# EAGLE design MicromouseV0.0.5 (EAGLE 9.4.2)
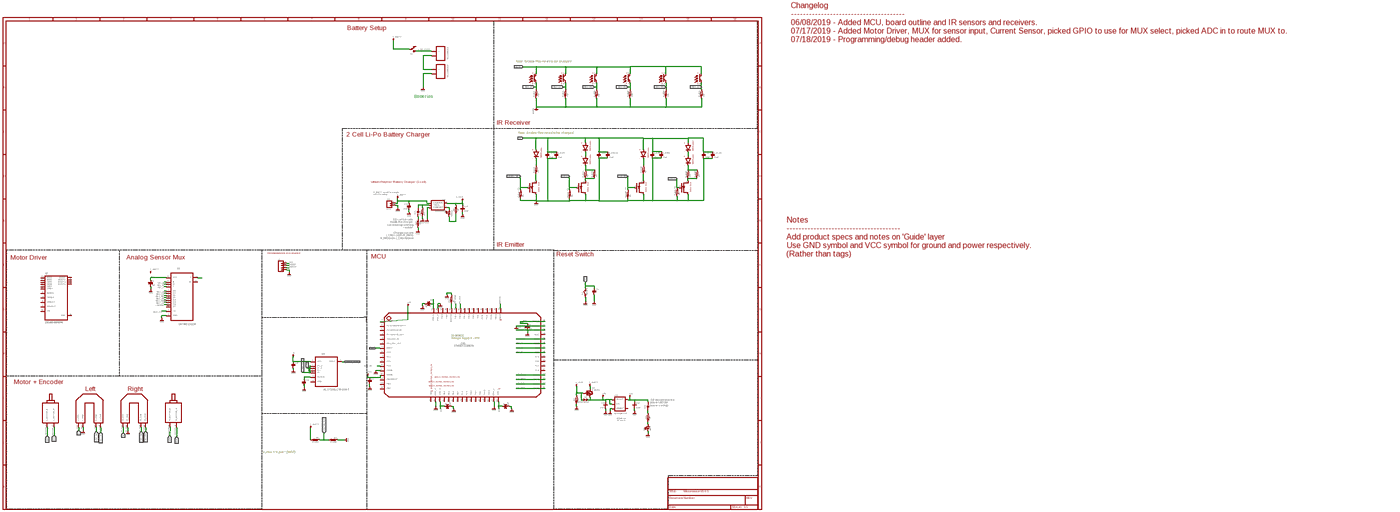
[diagram p0: schematic, sheet 1, overview]
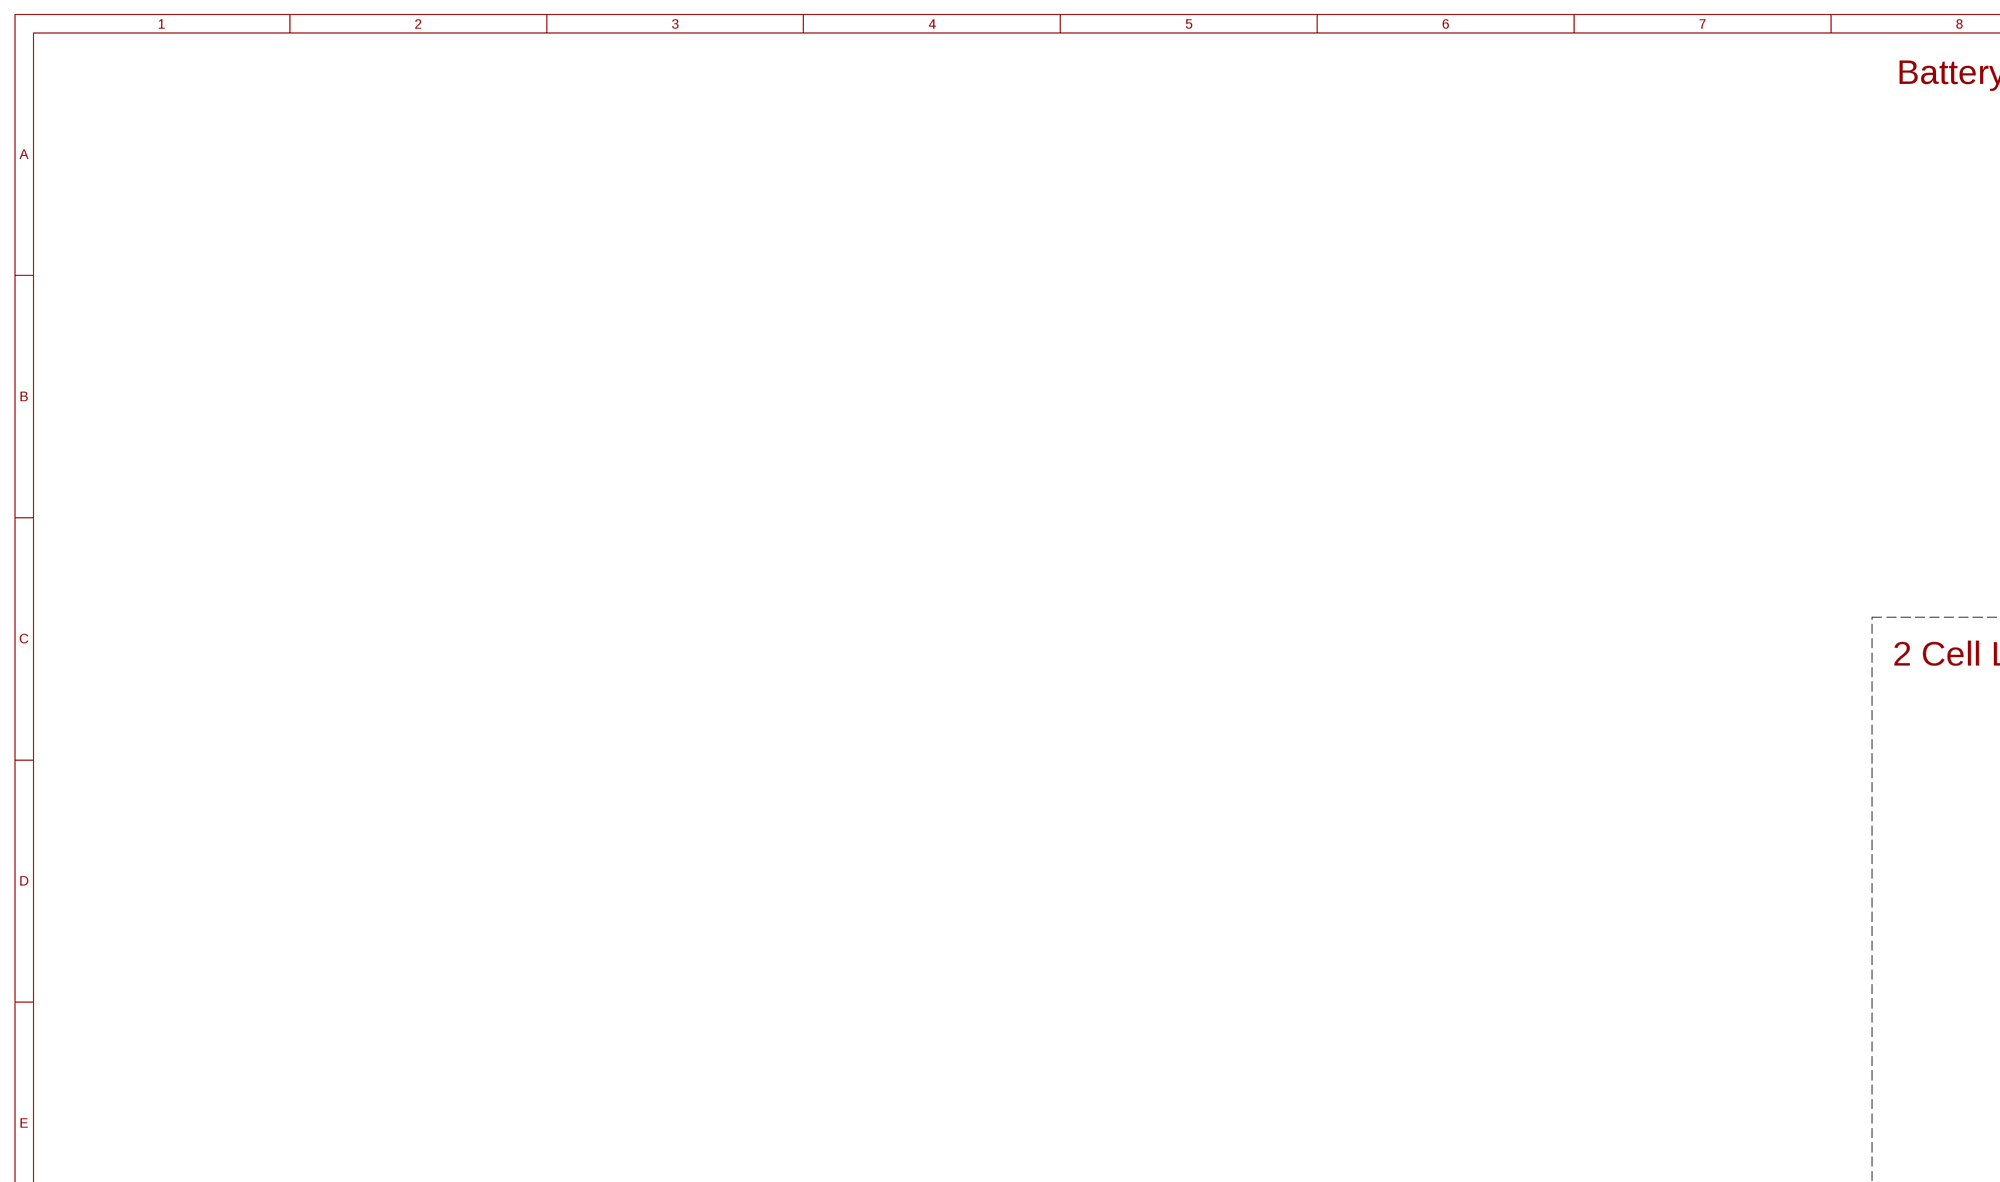
[diagram p1: schematic, sheet 1, part 1 of 6]
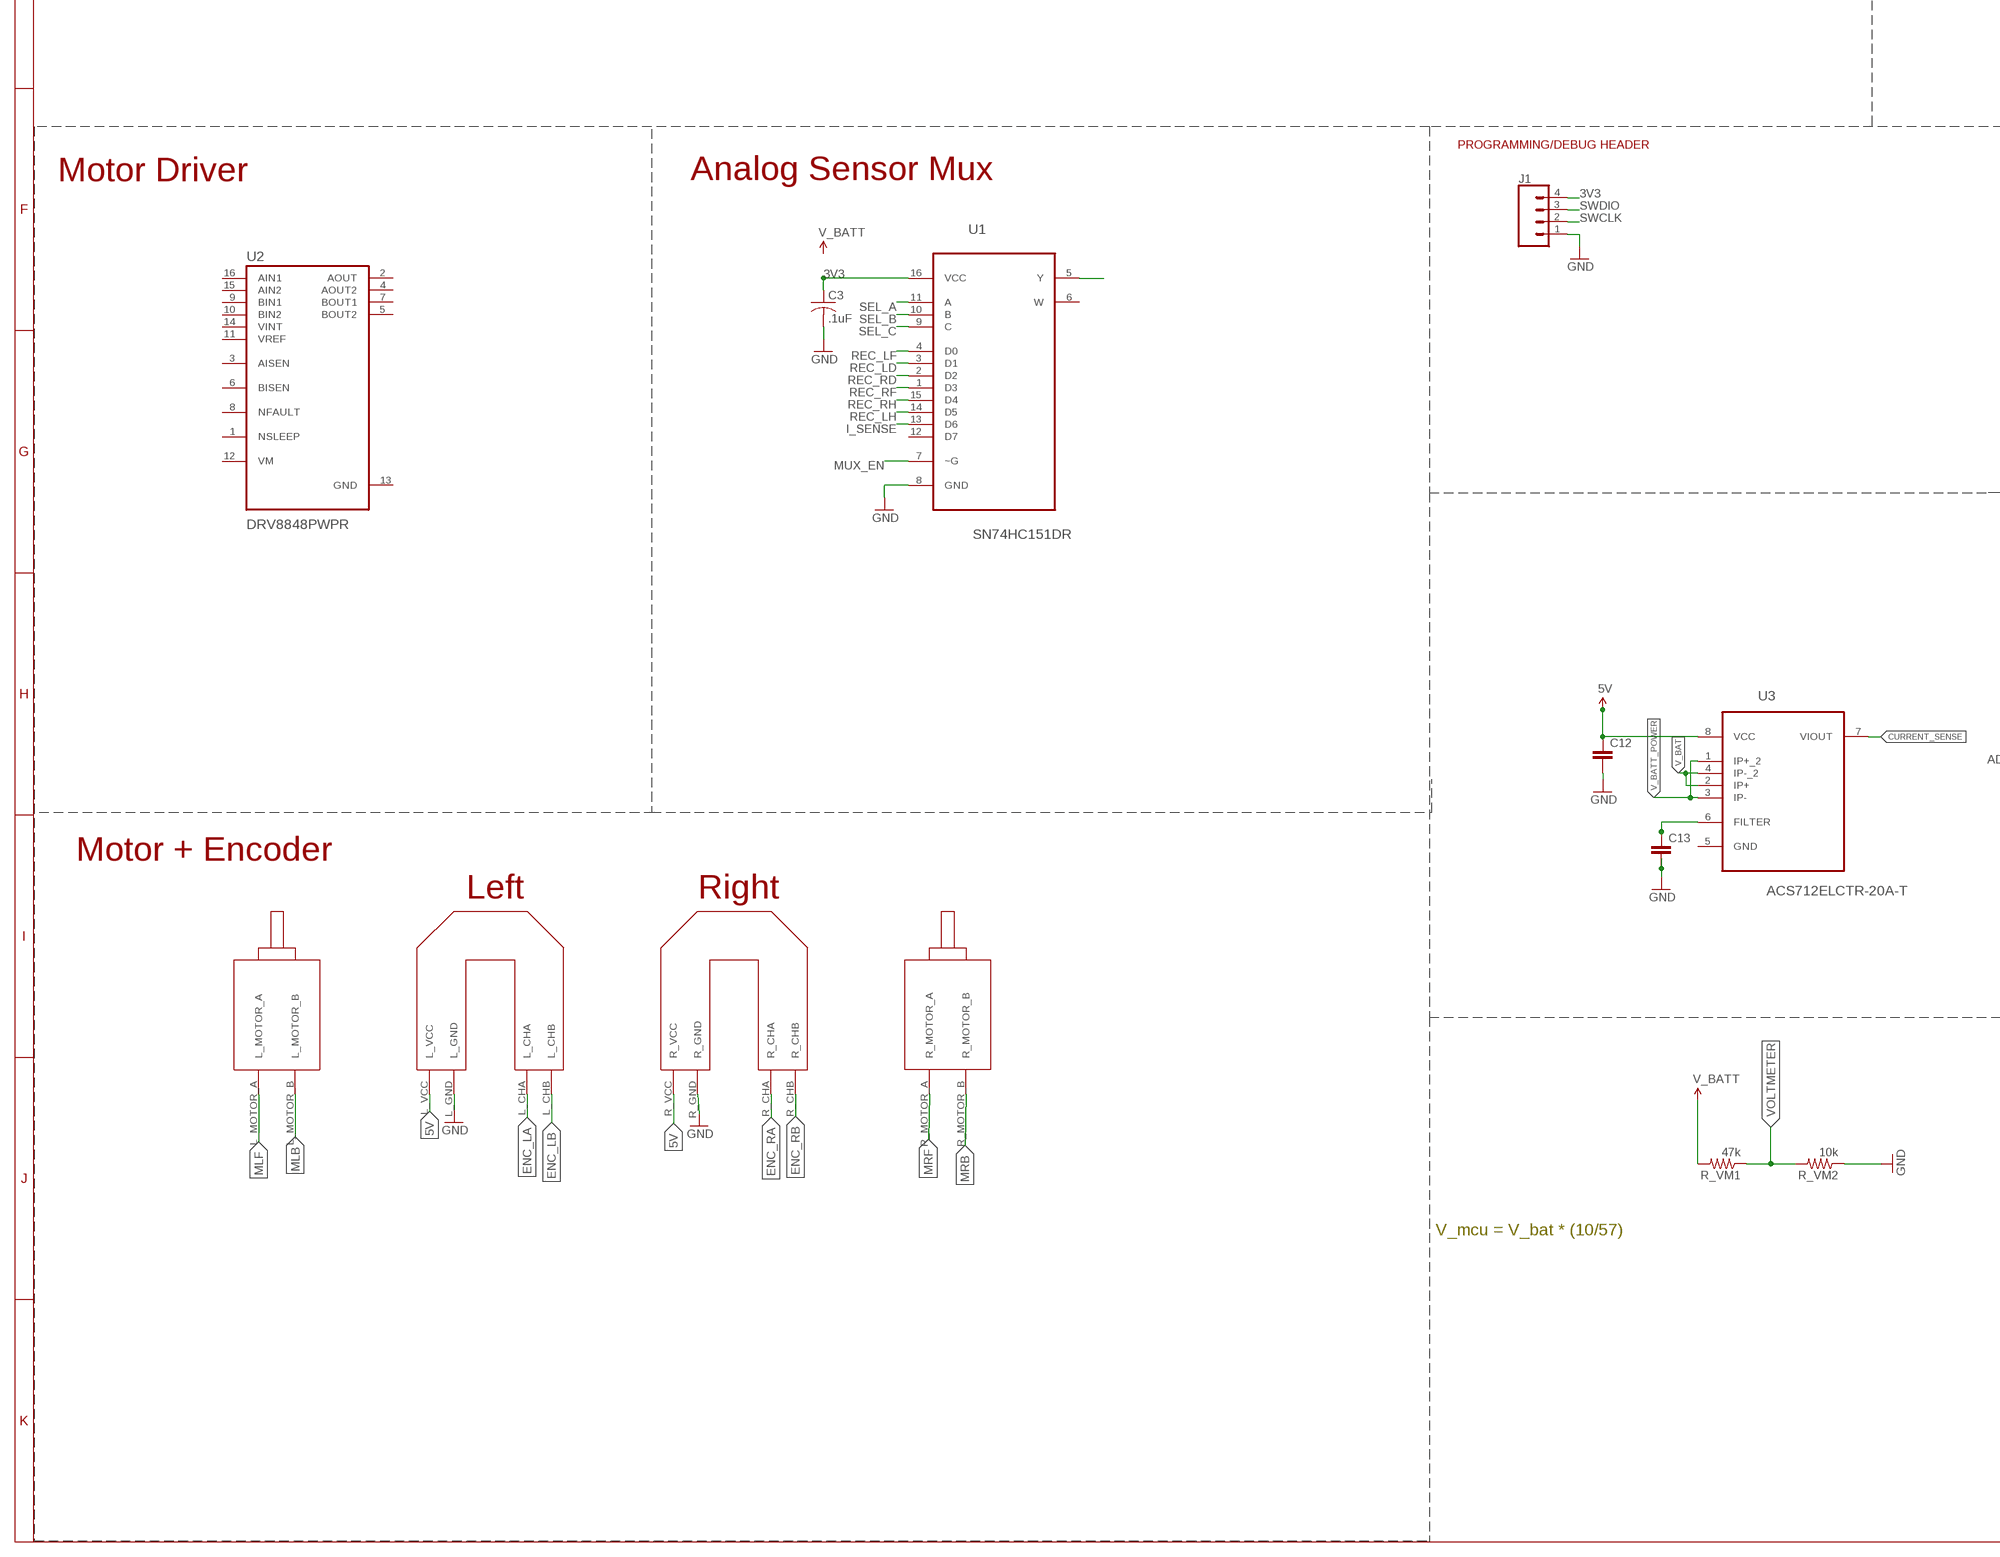
[diagram p2: schematic, sheet 1, part 2 of 6]
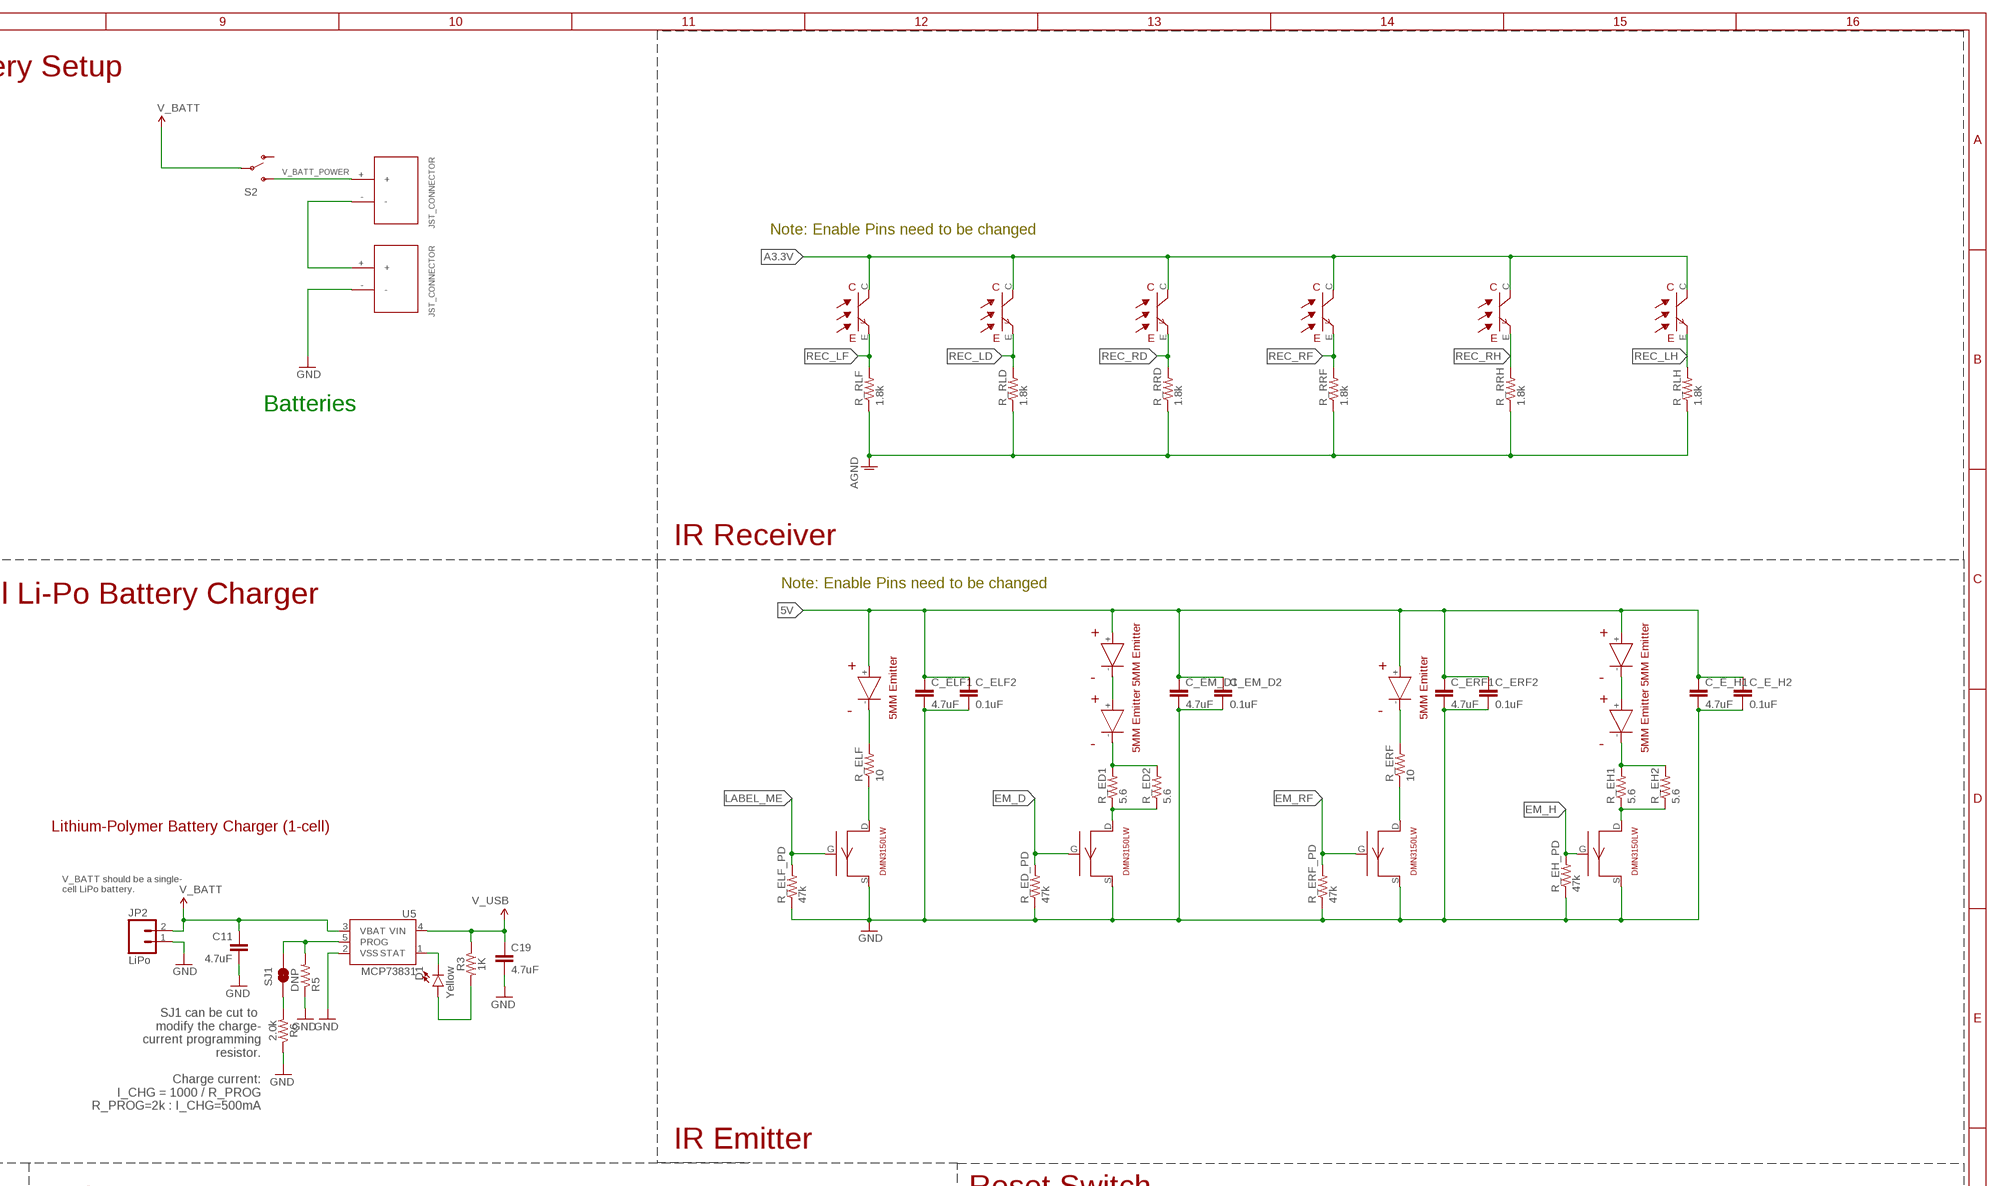
[diagram p3: schematic, sheet 1, part 3 of 6]
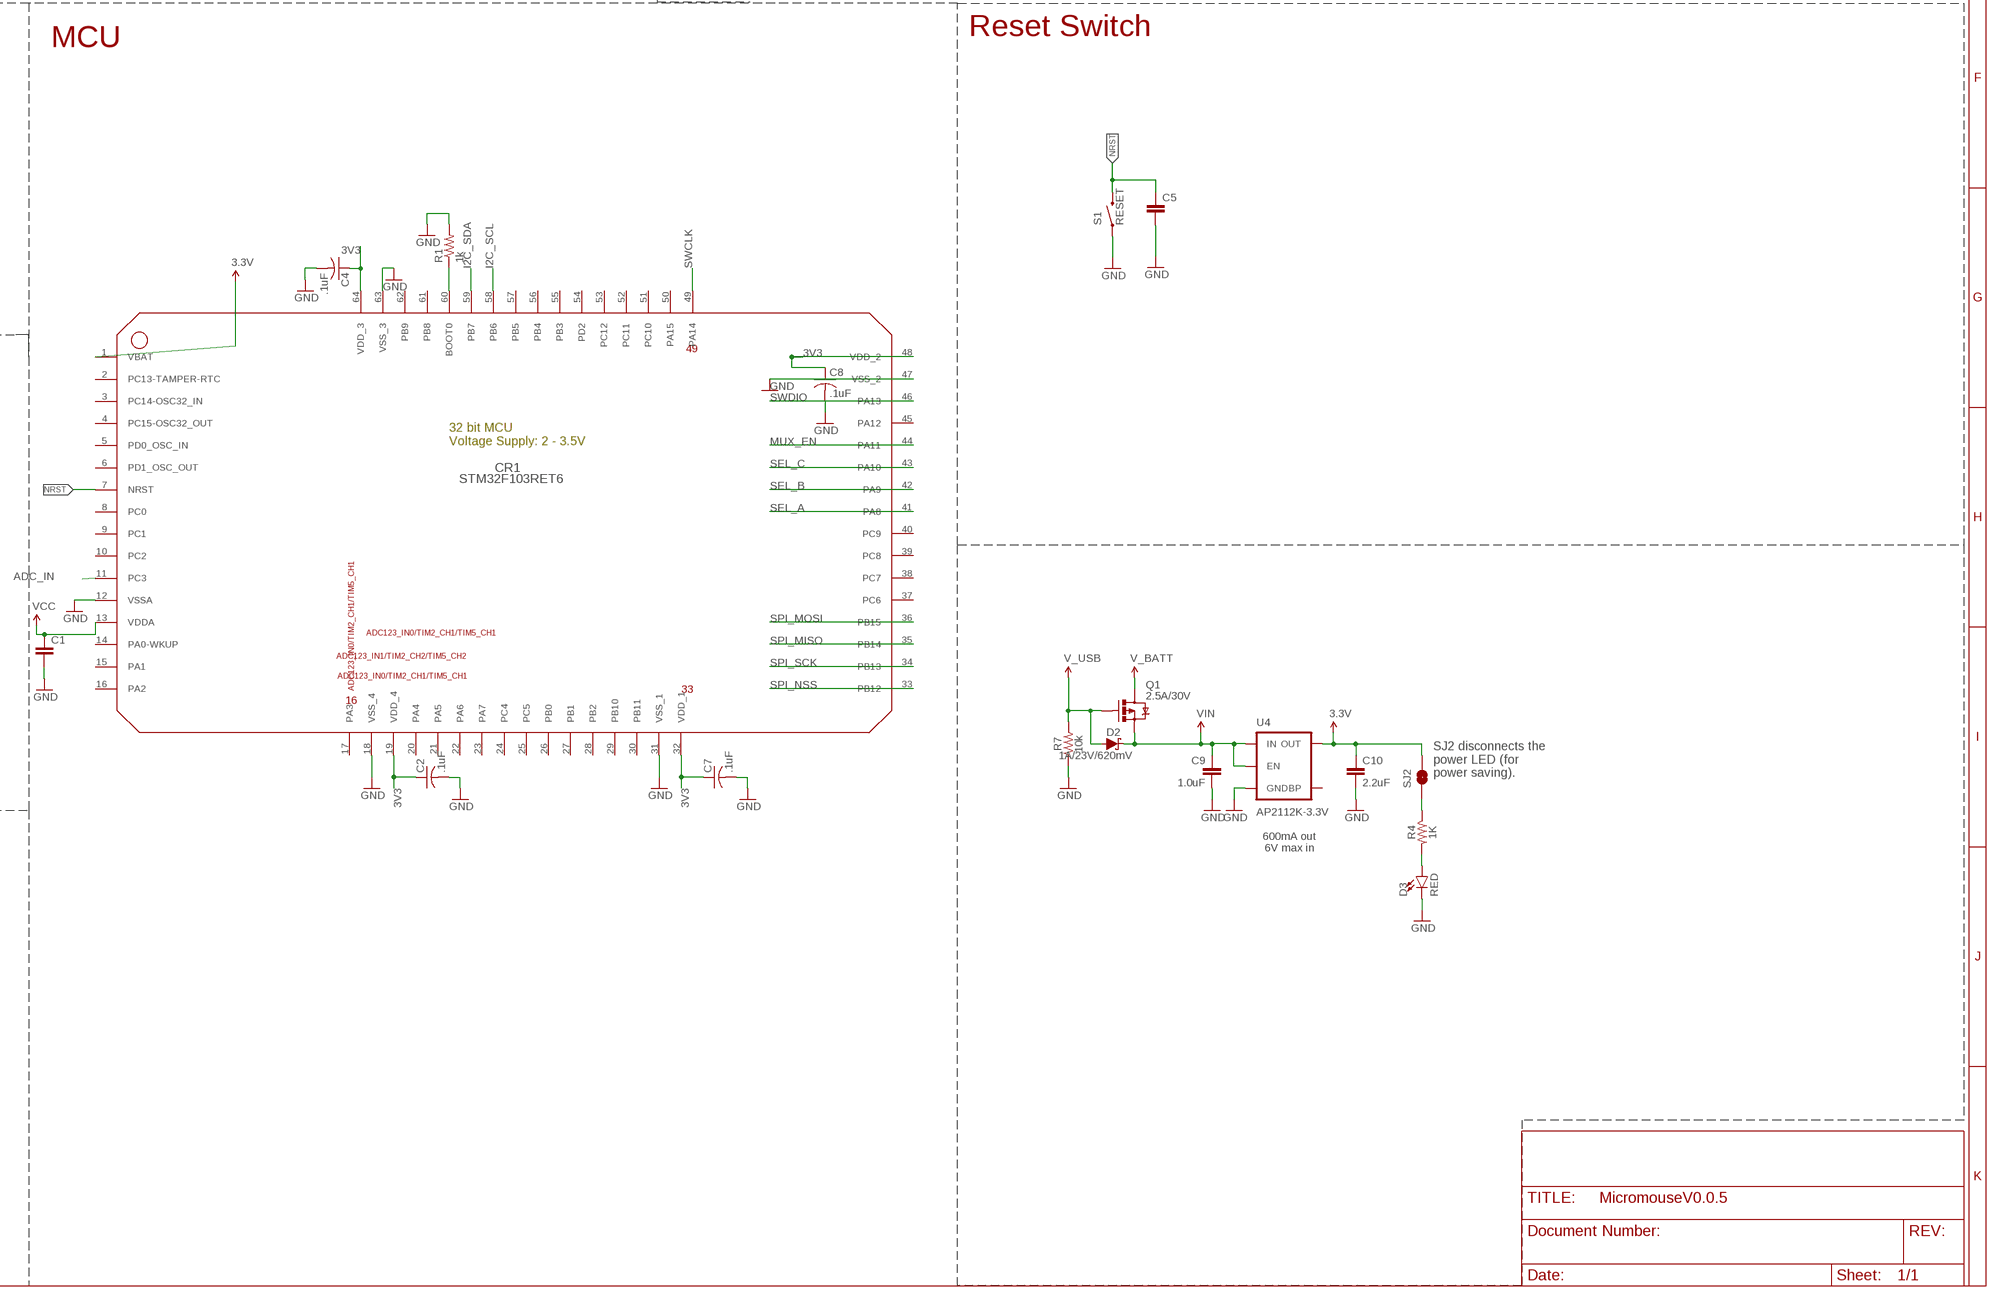
[diagram p4: schematic, sheet 1, part 4 of 6]
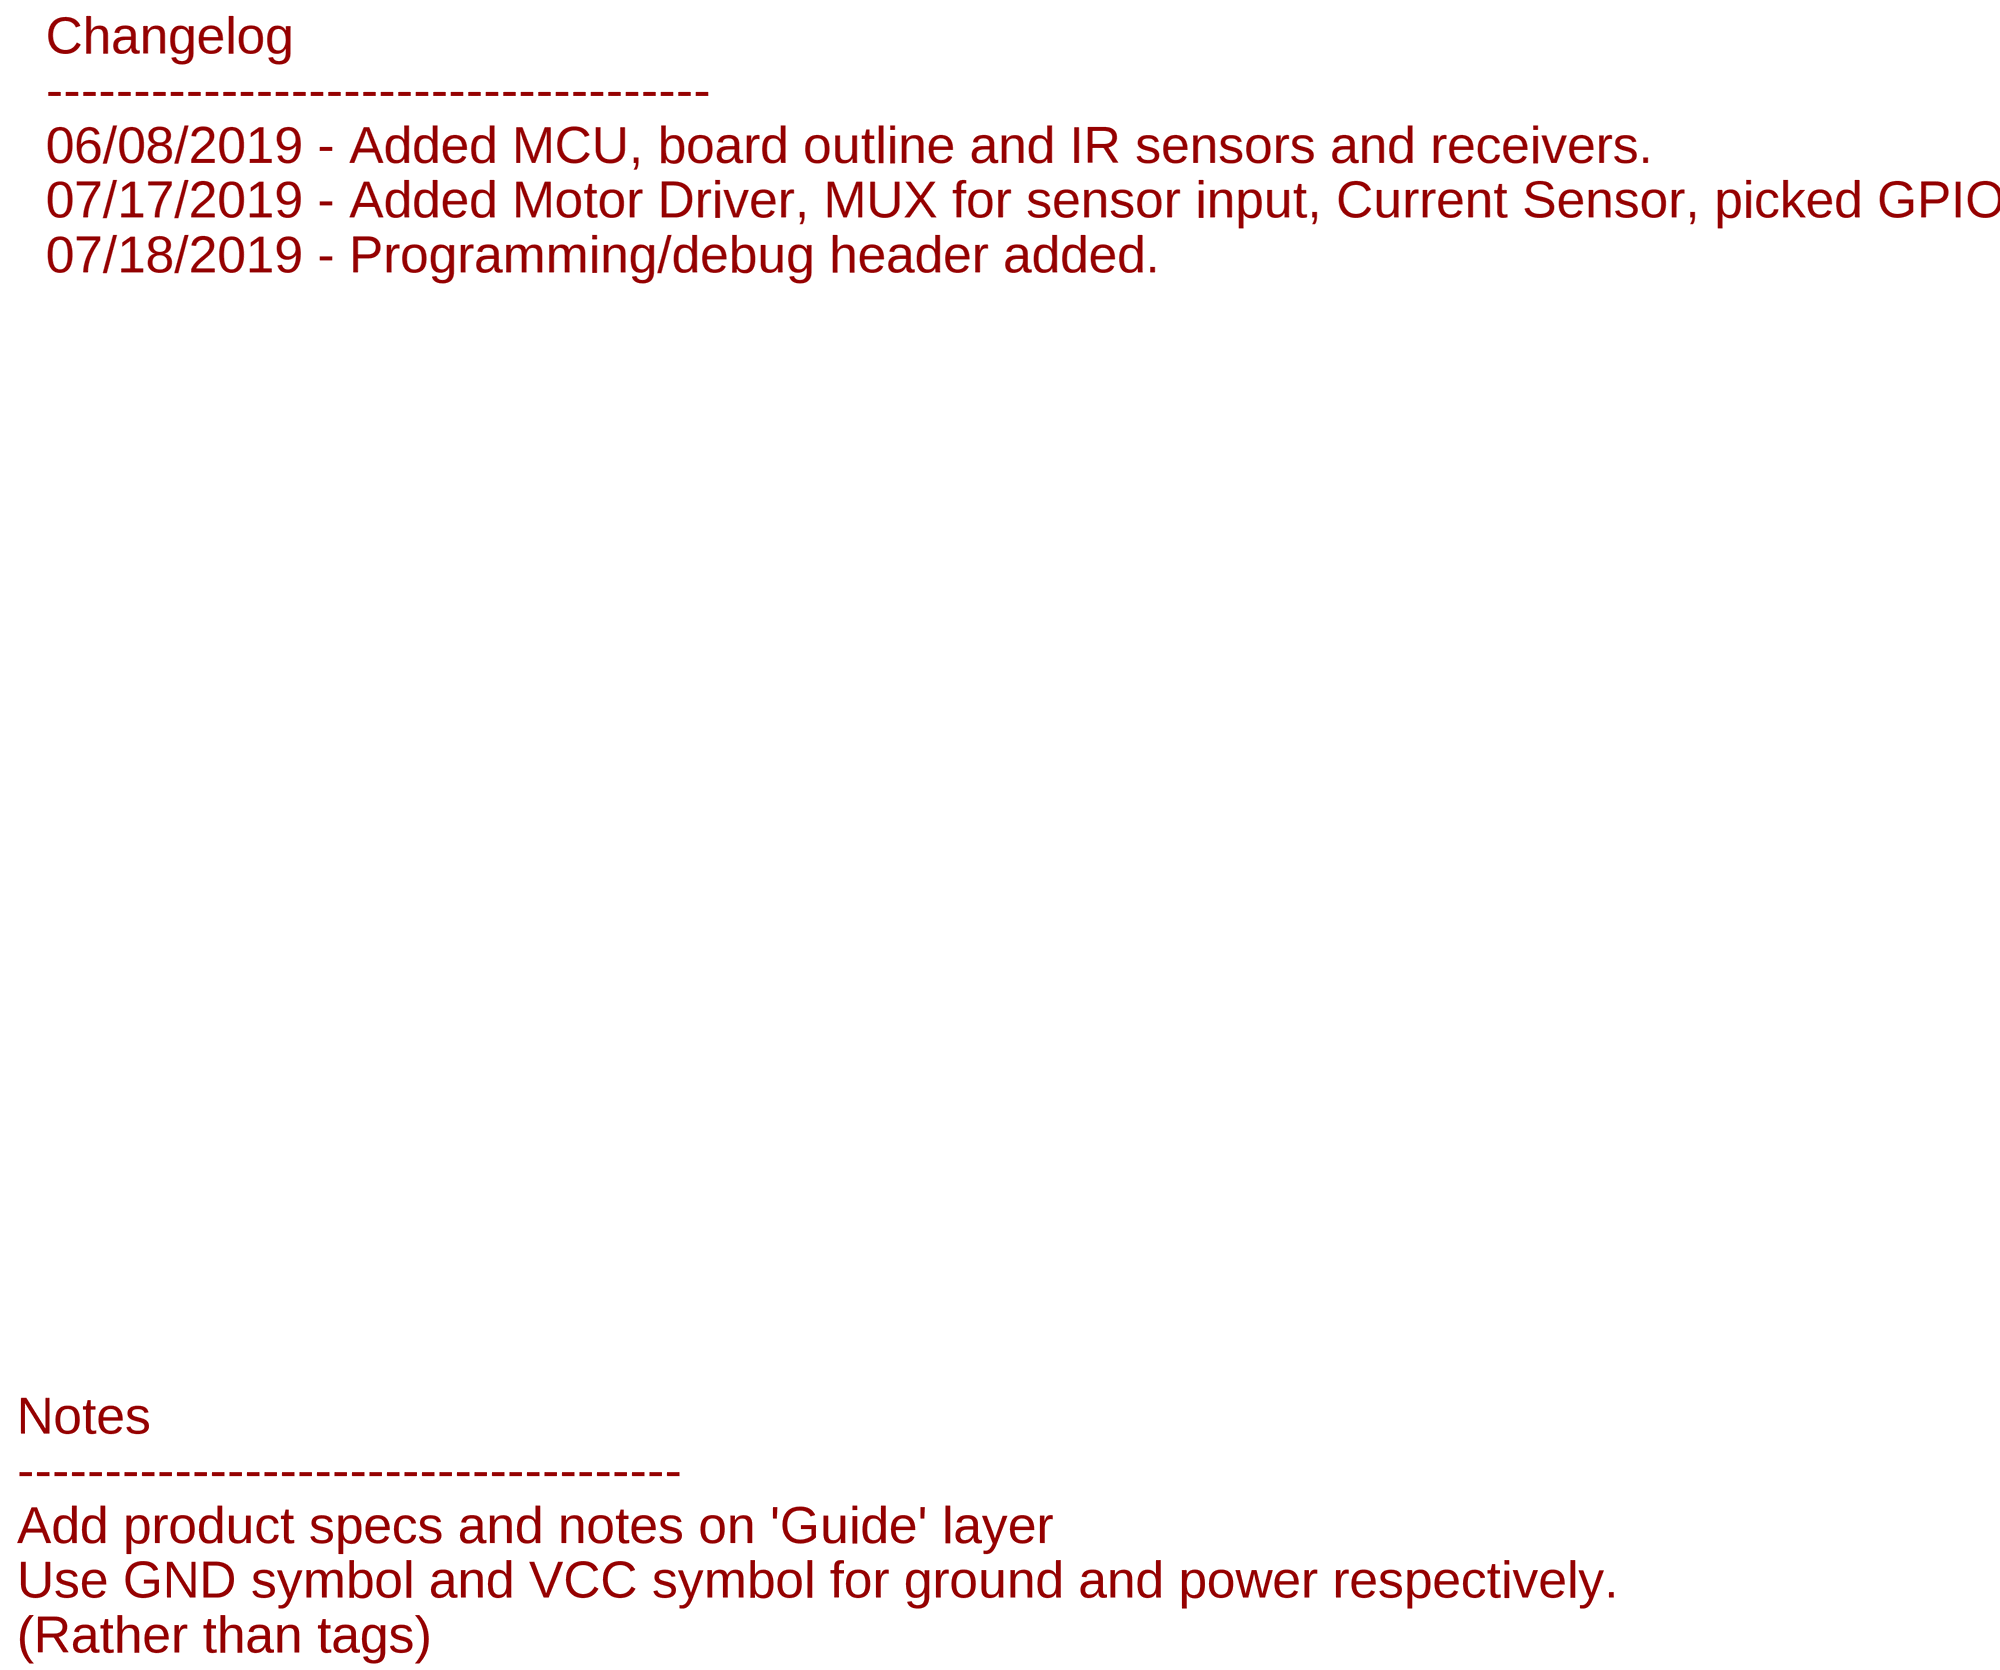
[diagram p5: schematic, sheet 1, part 5 of 6]
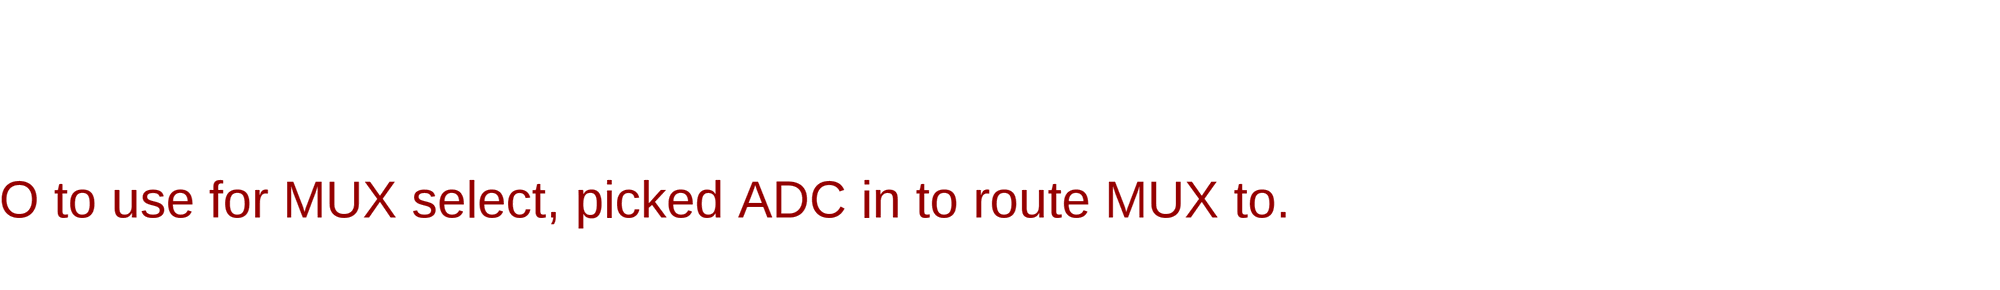
[diagram p6: schematic, sheet 1, part 6 of 6]

## Parts
C1  CAP0603-CAP  [0603-CAP]
C2  .1uF  C-USC0603  [C0603]
C3  .1uF  C-USC0603  [C0603]
C4  .1uF  C-USC0603  [C0603]
C5  CAP0603-CAP  [0603-CAP]
C7  .1uF  C-USC0603  [C0603]
C8  .1uF  C-USC0603  [C0603]
C9  1.0uF  1.0UF-0805-25V-(+80/-20%)  [0805]
C10  2.2uF  2.2UF-0603-10V-20%  [0603]
C11  4.7uF  4.7UF-0603-6.3V-(10%)  [0603]
C12  CAP0603-CAP  [0603-CAP]
C13  CAP0603-CAP  [0603-CAP]
C19  4.7uF  4.7UF-0603-6.3V-(10%)  [0603]
C_E_H1  4.7uF  CAP0603-CAP  [0603-CAP]
C_E_H2  0.1uF  CAP0603-CAP  [0603-CAP]
C_ELF1  4.7uF  CAP0603-CAP  [0603-CAP]
C_ELF2  0.1uF  CAP0603-CAP  [0603-CAP]
C_EM_D1  4.7uF  CAP0603-CAP  [0603-CAP]
C_EM_D2  0.1uF  CAP0603-CAP  [0603-CAP]
C_ERF1  4.7uF  CAP0603-CAP  [0603-CAP]
C_ERF2  0.1uF  CAP0603-CAP  [0603-CAP]
CR1  STM32F103RET6  [LQFP-64]
D1  Yellow  LED-YELLOW0603  [LED-0603]
D2  1A/23V/620mV  DIODE-SCHOTTKY-BAT20J  [SOD-323]
D3  RED  LED-RED0603  [LED-0603]
J1  CONN_04  [1X04]
JP2  LiPo  M02JST-PTH-2  [JST-2-PTH]
LEFT_FRONT_EMITTER  EMITTER  [EMITTER]
NMOS1  DMN3150LW  [DMN3150LW]
NMOS2  DMN3150LW  [DMN3150LW]
NMOS3  DMN3150LW  [DMN3150LW]
NMOS4  DMN3150LW  [DMN3150LW]
Q1  2.5A/30V  MOSFET-PCHANNELDMG2307L  [SOT23-3@1]
R1  1k  R-US_M0805  [M0805]
R3  1K  1KOHM-1/10W-1%(0603)  [0603]
R4  1K  1KOHM-1/10W-1%(0603)  [0603]
R5  DNP  RESISTORPTH-1/6W  [1/6W-RES]
R6  2.0k  2.0KOHM1/10W5%(0603)  [0603]
R7  10k  10KOHM-0603-1/10W-1%  [0603]
R_ED1  5.6  RESISTOR0603-RES  [0603-RES]
R_ED2  5.6  RESISTOR0603-RES  [0603-RES]
R_ED_PD  47k  RESISTOR0603-RES  [0603-RES]
R_EH1  5.6  RESISTOR0603-RES  [0603-RES]
R_EH2  5.6  RESISTOR0603-RES  [0603-RES]
R_EH_PD  47k  RESISTOR0603-RES  [0603-RES]
R_ELF  10  RESISTOR0603-RES  [0603-RES]
R_ELF_PD  47k  RESISTOR0603-RES  [0603-RES]
R_ERF  10  RESISTOR0603-RES  [0603-RES]
R_ERF_PD  47k  RESISTOR0603-RES  [0603-RES]
R_RLD  1.8k  RESISTOR0603-RES  [0603-RES]
R_RLF  1.8k  RESISTOR0603-RES  [0603-RES]
R_RLH  1.8k  RESISTOR0603-RES  [0603-RES]
R_RRD  1.8k  RESISTOR0603-RES  [0603-RES]
R_RRF  1.8k  RESISTOR0603-RES  [0603-RES]
R_RRH  1.8k  RESISTOR0603-RES  [0603-RES]
R_VM1  47k  RESISTOR0603-RES  [0603-RES]
R_VM2  10k  RESISTOR0603-RES  [0603-RES]
REC_LF  RECEIVER  [RECEIVER]
S1  RESET  SWITCH-MOMENTARY-2SMD-4.6X2.8MM  [TACTILE_SWITCH_SMD_4.6X2.8MM]
S2  SWITCH-SPSTPTH  [SWITCH-SPDT]
SJ1  JUMPER-PAD-2-NC_BY_TRACE  [PAD-JUMPER-2-NC_BY_TRACE_YES_SILK]
SJ2  JUMPER-PAD-2-NC_BY_TRACE  [PAD-JUMPER-2-NC_BY_TRACE_YES_SILK]
U1  SN74HC151DR  [SOIC127P600X175-16N]
U2  DRV8848PWPR  [SOP65P640X120-17N]
U3  ACS712ELCTR-20A-T  [SOIC127P600X175-8N]
U4  AP2112K-3.3V  V_REG_LDOSMD  [SOT23-5]
U5  MCP73831  [SOT23-5]
U$1  JST_CONNECTOR_FEMALE  [JST_CONNECTOR_FEMALE]
U$2  JST_CONNECTOR_FEMALE  [JST_CONNECTOR_FEMALE]
U$7  RECEIVER  [RECEIVER]
U$8  RECEIVER  [RECEIVER]
U$9  RECEIVER  [RECEIVER]
U$11  EMITTER  [EMITTER]
U$12  MY_MM_MOTOR_MOUNT  [MY_MM_MOTOR_MOUNT]
U$13  EMITTER  [EMITTER]
U$17  EMITTER  [EMITTER]
U$18  EMITTER  [EMITTER]
U$19  EMITTER  [EMITTER]
U$20  RECEIVER  [RECEIVER]
U$21  RECEIVER  [RECEIVER]

## Nets
3.3V: C10.1 CR1.1(VBAT) SJ2.2 U4.5(OUT)
3V3: C2.1 C3.1 C4.1 C7.1 C8.1 CR1.19(VDD_4) CR1.32(VDD_1) CR1.48(VDD_2) CR1.64(VDD_3) J1.4 U1.16(VCC)
5V: C_E_H1.1 C_E_H2.1 C_ELF1.1 C_ELF2.1 C_EM_D1.1 C_EM_D2.1 C_ERF1.1 C_ERF2.1 LEFT_FRONT_EMITTER.+ U$11.+ U$12.L_VCC U$12.R_VCC U$13.+ U$18.+
A3.3V: REC_LF.C U$7.C U$8.C U$9.C U$20.C U$21.C
ADC_IN: CR1.11(PC3)
AGND: R_RLD.1 R_RLF.1 R_RLH.1 R_RRD.1 R_RRF.1 R_RRH.1
CURRENT_SENSE: U3.7(VIOUT)
D2_EM: R_ED1.2 R_ED2.2 U$17.-
D_EM: U$11.- U$17.+
EM_D: NMOS2.G R_ED_PD.2
EM_H: NMOS4.G R_EH_PD.2
EM_RF: NMOS3.G R_ERF_PD.2
ENC_LA: U$12.L_CHA
ENC_LB: U$12.L_CHB
ENC_RA: U$12.R_CHA
ENC_RB: U$12.R_CHB
GND: C1.2 C2.2 C3.2 C4.2 C5.2 C7.2 C8.2 C9.2 C10.2 C11.2 C12.2 C13.2 C19.2 C_E_H1.2 C_E_H2.2 C_ELF1.2 C_ELF2.2 C_EM_D1.2 C_EM_D2.2 C_ERF1.2 C_ERF2.2 CR1.12(VSSA) CR1.18(VSS_4) CR1.31(VSS_1) CR1.47(VSS_2) CR1.63(VSS_3) D3.C J1.1 JP2.1 NMOS1.S NMOS2.S NMOS3.S NMOS4.S R1.2 R5.1 R6.1 R7.1 R_ED_PD.1 R_EH_PD.1 R_ELF_PD.1 R_ERF_PD.1 R_VM2.1 S1.1 S1.2 U1.8(GND) U4.2(GND) U5.2(VSS) U$1.- U$12.L_GND U$12.R_GND
H2_EM: R_EH1.2 R_EH2.2 U$19.-
H_EM: U$18.- U$19.+
I2C_SCL: CR1.58(PB6)
I2C_SDA: CR1.59(PB7)
I_SENSE: U1.13(D6)
LABEL_ME: NMOS1.G R_ELF_PD.2
LF_EM: LEFT_FRONT_EMITTER.- R_ELF.2
MLB: U$12.L_MOTOR_B
MLF: U$12.L_MOTOR_A
MRB: U$12.R_MOTOR_B
MRF: U$12.R_MOTOR_A
MUX_EN: CR1.44(PA11) U1.7(~G)
N$1: C13.1 U3.6(FILTER)
N$2: U1.5(Y)
N$5: NMOS3.D R_ERF.1
N$6: D3.A R4.2
N$7: NMOS1.D R_ELF.1
N$8: R4.1 SJ2.1
N$9: CR1.60(BOOT0) R1.1
N$10: D1.C U5.1(STAT)
N$11: U$1.+ U$2.-
N$14: R5.2 SJ1.2 U5.5(PROG)
N$16: R6.2 SJ1.1
N$17: D1.A R3.2
N$18: NMOS2.D R_ED1.1 R_ED2.1
N$19: NMOS4.D R_EH1.1 R_EH2.1
NRST: C5.1 CR1.7(NRST) S1.3 S1.4
REC_LD: R_RLD.2 U1.3(D1) U$7.E
REC_LF: R_RLF.2 REC_LF.E U1.4(D0)
REC_LH: R_RLH.2 U1.14(D5) U$21.E
REC_RD: R_RRD.2 U1.2(D2) U$8.E
REC_RF: R_RRF.2 U1.1(D3) U$9.E
REC_RH: R_RRH.2 U1.15(D4) U$20.E
RF_EM: R_ERF.2 U$13.-
SEL_A: CR1.41(PA8) U1.11(A)
SEL_B: CR1.42(PA9) U1.10(B)
SEL_C: CR1.43(PA10) U1.9(C)
SPI_MISO: CR1.35(PB14)
SPI_MOSI: CR1.36(PB15)
SPI_NSS: CR1.33(PB12)
SPI_SCK: CR1.34(PB13)
SWCLK: CR1.49(PA14) J1.2
SWDIO: CR1.46(PA13) J1.3
V_BAT: U3.2(IP+) U3.4(IP-_2)
V_BATT: C11.1 C12.1 JP2.2 Q1.3(D) R_VM1.2 S2.2(P) U3.8(VCC) U5.3(VBAT) ; supply symbol labelled 5V
V_BATT_POWER: S2.3(S) U3.1(IP+_2) U3.3(IP-) U$2.+
V_USB: C19.1 D2.A Q1.1(G) R3.1 R7.2 U5.4(VIN)
VCC: C1.1 CR1.13(VDDA)
VIN: C9.1 D2.C Q1.2(S) U4.1(IN) U4.3(EN)
VOLTMETER: R_VM1.1 R_VM2.2
Unconnected: CR1.2(PC13-TAMPER-RTC) CR1.3(PC14-OSC32_IN) CR1.4(PC15-OSC32_OUT) CR1.5(PD0_OSC_IN) CR1.6(PD1_OSC_OUT) CR1.8(PC0) CR1.9(PC1) CR1.10(PC2) CR1.14(PA0-WKUP) CR1.15(PA1) CR1.16(PA2) CR1.17(PA3) CR1.20(PA4) CR1.21(PA5) CR1.22(PA6) CR1.23(PA7) CR1.24(PC4) CR1.25(PC5) CR1.26(PB0) CR1.27(PB1) CR1.28(PB2) CR1.29(PB10) CR1.30(PB11) CR1.37(PC6) CR1.38(PC7) CR1.39(PC8) CR1.40(PC9) CR1.45(PA12) CR1.50(PA15) CR1.51(PC10) CR1.52(PC11) CR1.53(PC12) CR1.54(PD2) CR1.55(PB3) CR1.56(PB4) CR1.57(PB5) CR1.61(PB8) CR1.62(PB9) S2.1(O) U1.6(W) U1.12(D7) U2.1(NSLEEP) U2.2(AOUT) U2.3(AISEN) U2.4(AOUT2) U2.5(BOUT2) U2.6(BISEN) U2.7(BOUT1) U2.8(NFAULT) U2.9(BIN1) U2.10(BIN2) U2.11(VREF) U2.12(VM) U2.14(VINT) U2.15(AIN2) U2.16(AIN1) U3.5(GND) U4.4(BP)

## Notes on the sheet
- Battery Setup
- Changelog
  --------------------------------------
  06/08/2019 - Added MCU, board outline and IR sensors and receivers.                                      
  07/17/2019 - Added Motor Driver, MUX for sensor input, Current Sensor, picked GPIO to use for MUX select, picked ADC in to route MUX to. 
  07/18/2019 - Programming/debug header added.
- Note: Enable Pins need to be changed
- Batteries
- IR Receiver
- Note: Enable Pins need to be changed
- 2 Cell Li-Po Battery Charger
- Lithium-Polymer Battery Charger (1-cell)
- V_BATT should be a single-
  cell LiPo battery.
- SJ1 can be cut to 
  modify the charge-
  current programming
  resistor.
- Charge current:
  I_CHG = 1000 / R_PROG
  R_PROG=2k : I_CHG=500mA
- IR Emitter
- PROGRAMMING/DEBUG HEADER
- Reset Switch
- Notes
  --------------------------------------
  Add product specs and notes on 'Guide' layer
  Use GND symbol and VCC symbol for ground and power respectively.
  (Rather than tags)
- Motor Driver | Analog Sensor Mux | MCU
- 32 bit MCU
  Voltage Supply: 2 - 3.5V
- ADC123_IN0/TIM2_CH1/TIM5_CH1
- ADC123_IN1/TIM2_CH2/TIM5_CH2
- Motor + Encoder
- ADC123_IN0/TIM2_CH1/TIM5_CH1
- ADC123_IN0/TIM2_CH1/TIM5_CH1
- SJ2 disconnects the
  power LED (for 
  power saving).
- 600mA out
  6V max in
- V_mcu = V_bat * (10/57)

## Power pins joined to a net without a drawn wire
GND: U2.13(GND)

## Library data of the parts
C1 C5 C12 C13 C_E_H1 C_E_H2 C_ELF1 C_ELF2 C_EM_D1 C_EM_D2 C_ERF1 C_ERF2 = MicromouseV0.0.4:CAP: Capacitor Standard 0603 ceramic capacitor, and 0.1" leaded capacitor.
C2-C4 C7 C8 = rcl:C-US: CAPACITOR, American symbol; SPICEPREFIX: C
C9 = SparkFun-Capacitors:1.0UF: 1µF ceramic capacitors A capacitor is a passive two-terminal electrical component used to store electrical energy temporarily in an electric field.; PROD_ID: CAP-11625
C10 = SparkFun-Capacitors:2.2UF: 2.2µF ceramic capacitors A capacitor is a passive two-terminal electrical component used to store electrical energy temporarily in an electric field.; PROD_ID: CAP-07888
C11 C19 = SparkFun-Capacitors:4.7UF: 4.7µF ceramic capacitors A capacitor is a passive two-terminal electrical component used to store electrical energy temporarily in an electric field.; PROD_ID: CAP-08280
CR1 = MicromouseV0.0.4:STM32F103RET6; MANUFACTURER_PART_NUMBER: STM32F103RET6; VENDOR: STMicroelectronics
D1 = SparkFun-LED:LED-YELLOW: Yellow SMD LED Used in manufacturing several products at SparkFun. Packages: 0603 - SMD 0603 package[Product Link] <http://www.kingbrightusa.com/product.asp?catalog_name=LED&product_id=APT1608SYCK> 0603 -SMART - SMART SMD 0603 package (more efficient/more expensive) [Product Link] <http://www.osram-os.com/osram_os/en/products/product-catalog/led-light-emitting-diodes/smartled-0603/ly-l29k/index.jsp> LilyPad - SMD1206 package[Product Datasheet] <https://www.sparkfun.com/datasheets/DevTools/LilyPad/Q150YUS4.pdf> SparkFun Products: Blynk Board <https://www.sparkfun.com/products/13794> IOIO-OTG <https://www.sparkfun.com/products/13613> XBee Explorer Serial <https://www.sparkfun.com/products/13225>; PROD_ID: DIO-09003
D2 = SparkFun-DiscreteSemi:DIODE-SCHOTTKY: Schottky diode A Schottky diode is a semiconductor diode which has a low forward voltage drop and a very fast switching action.; PROD_ID: DIO-11623
D3 = SparkFun-LED:LED-RED: Red SMD LED Used in manufacturing of most products at SparkFun Packages: 0603 - SMD 0603 package [Product Link] <http://docs.avagotech.com/docs/AV02-0551EN> 0603 SMART - SMD 0603 SMART package ( more efficient and expensive)[Product Link] <http://www.osram-os.com/Graphics/XPic2/00077099_0.pdf> 1206 - SMD1206 package [Product Link] <https://www.sparkfun.com/datasheets/DevTools/LilyPad/Q150OVS4.pdff> SparkFun Products: Pro Mini 328 -5V <https://www.sparkfun.com/products/821> RedBoard <https://www.sparkfun.com/products/12757> IOIO-OTG <https://www.sparkfun.com/products/13613>; PROD_ID: DIO-00819
J1 = MicromouseV0.0.4:CONN_04: Multi connection point. Often used as Generic Header-pin footprint for 0.1 inch spaced/style header connections On any of the 0.1 inch spaced packages, you can populate with these: Break Away Headers - Straight <https://www.sparkfun.com/products/116> (PRT-00116) Break Away Male Headers - Right Angle <https://www.sparkfun.com/products/553> (PRT-00553) Female Headers <https://www.sparkfun.com/products/115> (PRT-00115) Break Away Headers - Machine Pin <https://www.sparkfun.com/products/117> (PRT-00117) Break Away Female Headers - Swiss Machine Pin <https://www.sparkfun.com/products/743> (PRT-00743) For SCREWTERMINALS and SPRING TERMINALS visit here: Screw Terimnals on SparkFun.com <https://www.sparkfun.com/search/results?term=Screw+Terminals> (5mm/3.5mm/2.54mm spacing) This device is also useful as a general connection point to wire up your design to another part of your project. Our various solder wires solder well into these plated through hole pads. Hook-Up Wire - Assortment (Stranded, 22 AWG) <https://www.sparkfun.com/products/11375> (PRT-11375) Hook-Up Wire - Assortment (Solid Core, 22 AWG) <https://www.sparkfun.com/products/11367> (PRT-11367) View the entire wire category on our website here <https://www.sparkfun.com/categories/141> Special notes: Molex polarized connector foot print use with SKU : PRT-08231 with associated crimp pins and housings. 1MM SMD Version SKU: PRT-10208; PROD_ID: CONN-09696
JP2 = SparkFun-Connectors:M02: Standard 2-pin 0.1" header. Use with - straight break away headers ( PRT-00116) - right angle break away headers (PRT-00553) - swiss pins (PRT-00743) - machine pins (PRT-00117) - female headers (PRT-00115) Molex polarized connector foot print use with: PRT-08233 with associated crimp pins and housings. 2.54_SCREWTERM for use with PRT-10571. 3.5mm Screw Terminal footprints for PRT-08084 5mm Screw Terminal footprints for use with PRT-08432; PROD_ID: CONN-09863; SKU: PRT-09914
LEFT_FRONT_EMITTER U$11 U$13 U$17-U$19 = MicromouseV0.0.4:EMITTER
NMOS1-NMOS4 = MicromouseV0.0.4:DMN3150LW
Q1 = SparkFun-DiscreteSemi:MOSFET-PCHANNEL: Generic PMOSFET IRLML2244 - TRANS-11153 (SOT-23 -20V -4.3A) (1.Gate 2.Source 3.Drain) FQP27P06 - COM-10349 <http://www.sparkfun.com/products/10349> (TO-220 -60V -27A) (1.Gate 2.Source 3.Drain); PROD_ID: TRANS-11308
R1 = rcl:R-US_: RESISTOR, American symbol; SPICEPREFIX: R
R3 R4 = SparkFun-Resistors:1KOHM-1/10W-1%(0603): RES-07856; PROD_ID: RES-07856
R5 R_VM1 R_VM2 = SparkFun-Passives:RESISTOR: Resistor Basic schematic elements and footprints for 0603, 1206, and PTH resistors.
R6 = SparkFun-Resistors:2.0KOHM1/10W5%(0603): RES-08296; PROD_ID: RES-08296
R7 = SparkFun-Resistors:10KOHM: 10kΩ resistor A resistor is a passive two-terminal electrical component that implements electrical resistance as a circuit element. Resistors act to reduce current flow, and, at the same time, act to lower voltage levels within circuits. - Wikipedia; PROD_ID: RES-00824
R_ED1 R_ED2 R_ED_PD R_EH1 R_EH2 R_EH_PD R_ELF R_ELF_PD R_ERF R_ERF_PD R_RLD R_RLF R_RLH R_RRD R_RRF R_RRH = MicromouseV0.0.4:RESISTOR: Resistor Basic schematic elements and footprints for 0603, 1206, and PTH resistors.
REC_LF U$7-U$9 U$20 U$21 = MicromouseV0.0.4:RECEIVER
S1 = SparkFun-Electromechanical:SWITCH-MOMENTARY-2: Various NO switches- pushbuttons, reed, etc; PROD_ID: SWCH-13065
S2 = SparkFun:SWITCH-SPST: SPST Switch Simple slide switch. Spark Fun Electronics SKU : COM-00102
SJ1 SJ2 = SparkFun-Passives:JUMPER-PAD-2-NC_BY_TRACE
U1 = MicromouseV0.0.4:SN74HC151DR: 8-Line to 1-Line Dataselectors /MultiPlexers; AVAILABILITY: Unavailable; DESCRIPTION: 8-Line To 1-Line Data Selectors/Multiplexers 16-SOIC -40 to 85; MF: Texas Instruments; MP: SN74HC151DR; PACKAGE: SOIC-16 Texas Instruments; PRICE: None
U2 = MicromouseV0.0.4:DRV8848PWPR: None; AVAILABILITY: Unavailable; DESCRIPTION: 2A Dual H-Bridge Motor Driver _PWM Control_ 16-HTSSOP -40 to 85; MF: Texas Instruments; MP: DRV8848PWPR; PACKAGE: HTSSOP-16 Texas Instruments; PRICE: None
U3 = MicromouseV0.0.4:ACS712ELCTR-20A-T: Linear Current Sensor; AVAILABILITY: Unavailable; DESCRIPTION: Fully Integrated, Hall Effect-Based Linear Current Sensor IC with 2.1 kVRMS Voltage Isolation and a Low-Resistance Cu...; MF: Allegro; MP: ACS712ELCTR-20A-T; PACKAGE: SOIC-8 Allegro MicroSystems LLC; PRICE: None
U4 = SparkFun-PowerIC:V_REG_LDO: Voltage Regulator LDO Standard 150mA LDO voltage regulator in SOT-23 layout. Micrel part MIC5205. BP (by-pass) pin is used to lower output noise with 470pF cap.; PROD_ID: VREG-12457
U5 = SparkFun-PowerIC:MCP73831: Miniature single cell, fully integrated Li-Ion, Li-polymer charge management controller http://ww1.microchip.com/downloads/en/DeviceDoc/20001984g.pdf IC-09995; PROD_ID: IC-09995
U$1 U$2 = JST_CONNECTOR_FEMALE. through hole:JST_CONNECTOR_FEMALE
U$12 = MicromouseV0.0.4:MY_MM_MOTOR_MOUNT

## Board
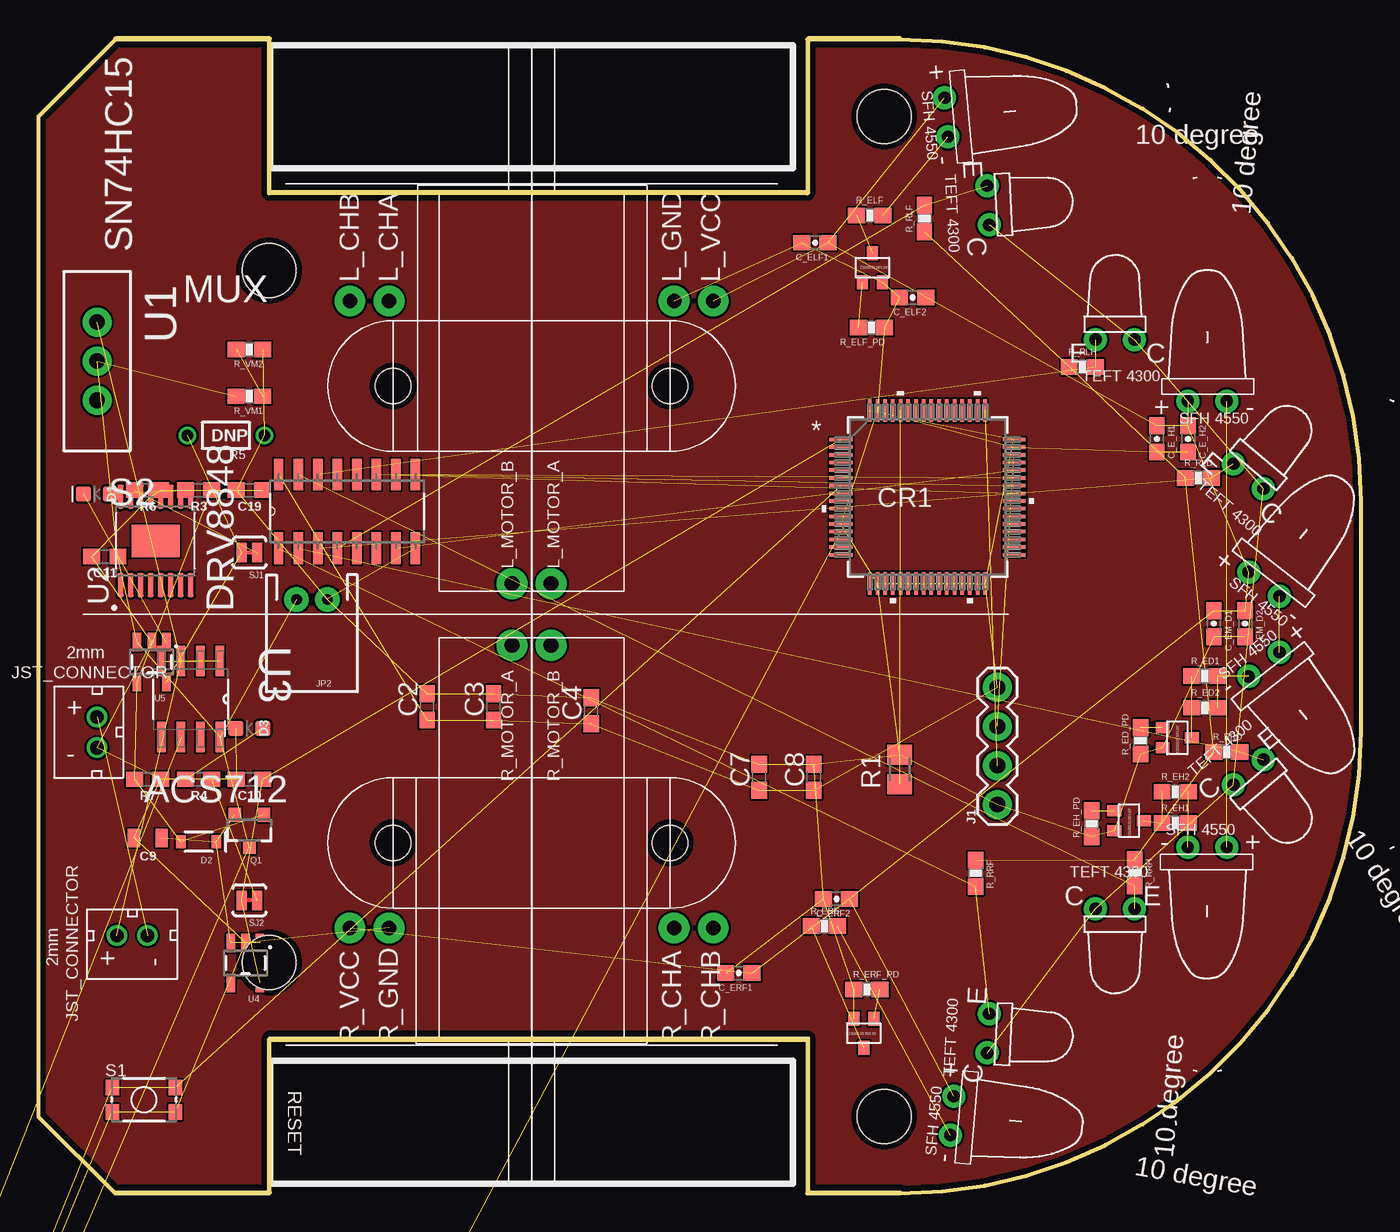
[diagram p7: board, top side]
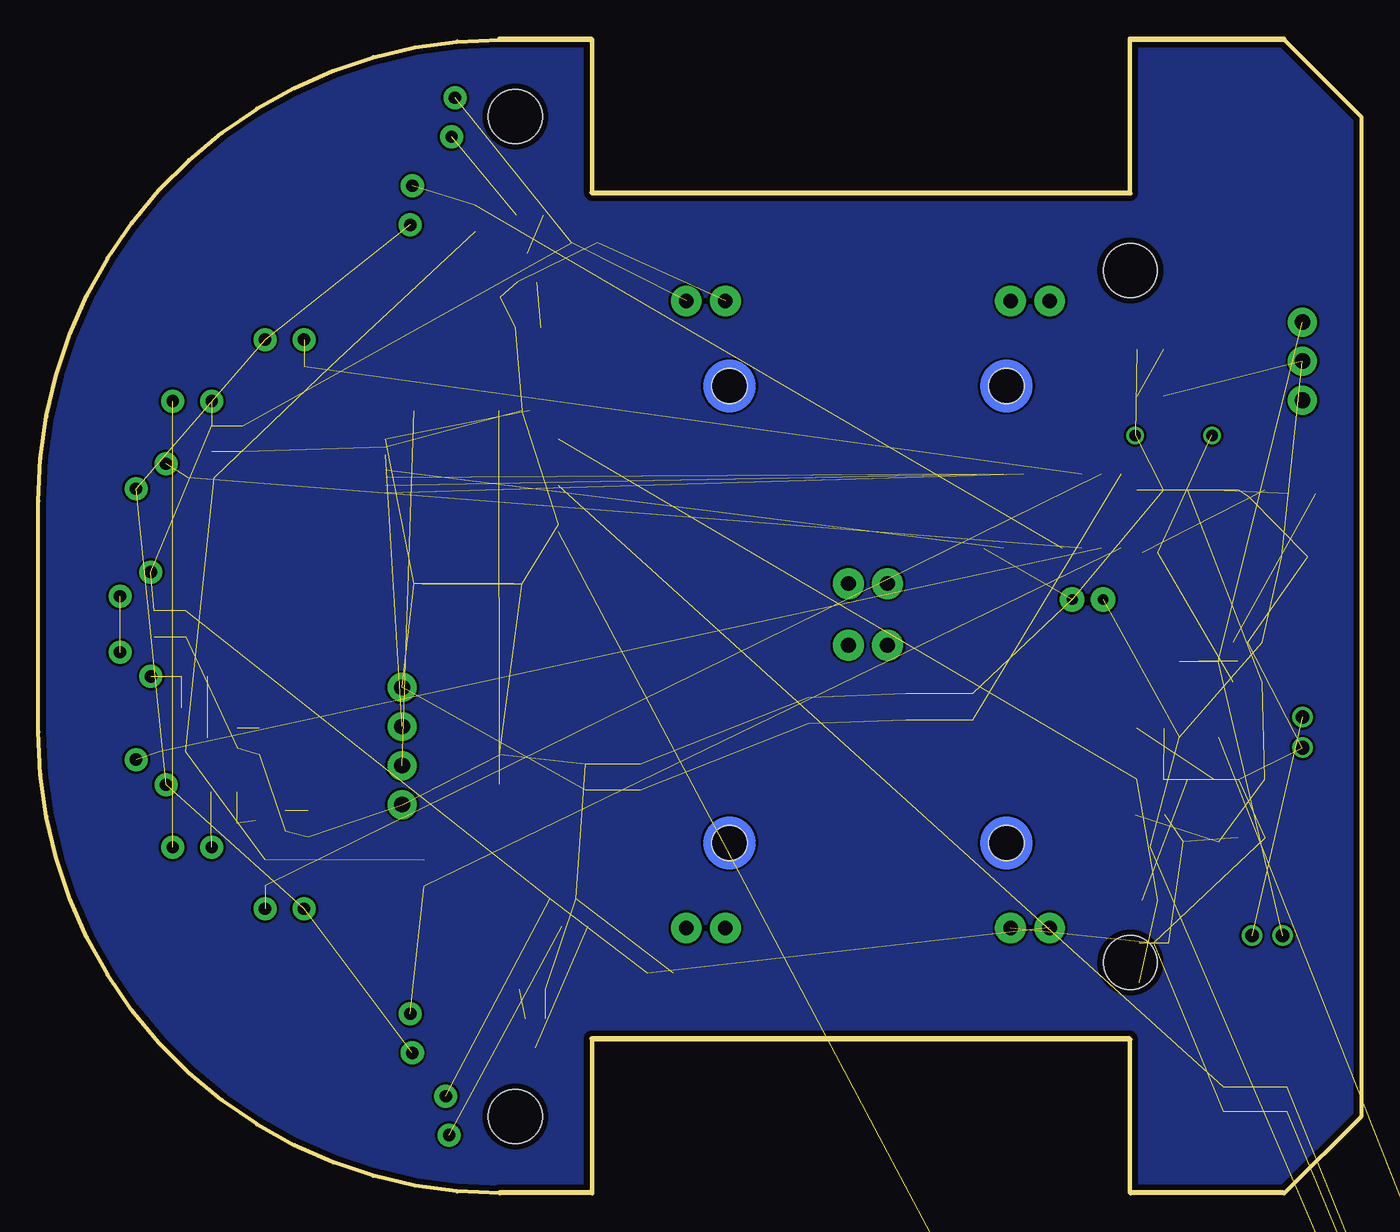
[diagram p8: board, bottom side, seen from below]

Size 86 x 75 mm. Coordinates in mm from the lower left corner, seen from the top.
Outline: 50,0 56,0 arc90 86,30 86,45 arc90 56,75 50,75 50,65 15,65 15,75 4.98,75 0,70 0,5 5,0 15,0 15,10 50,10 50,0
Copper layers (1*16): Top 0.0356mm / dielectric 1.5011mm / Bottom 0.0356mm
Design rules "LaenPCBOrder": minimum track width 6mil, minimum drill 13mil, track to track 6mil, track to pad 6mil, pad to pad 6mil, via to via 6mil, smd to smd 6mil, copper to edge 15mil, drill to drill 6mil, minimum pad ring 7mil, minimum via ring 7mil, stop-mask expansion 3mil, vias tented up to drill 0mil, thermal gap 10mil
Holes 3.5 mm at 15,15 55,70 15,60 55,5

### Footprints (pad centres in the part's own frame; a part is rotated, then mirrored left to right if it is on the bottom)
0603-CAP = smd 1.1 x 1: 1 -0.85,0; 2 0.85,0
C0603 = smd 1.1 x 1: 1 -0.85,0; 2 0.85,0
0805 = smd 0.8 x 1.2: 1 -0.9,0; 2 0.9,0
0603 = smd 1.1 x 1: 1 -0.85,0; 2 0.85,0
LQFP-64 = smd 1.473 x 0.229: 1 -5.626,3.75; 2 -5.626,3.25; 3 -5.626,2.75; 4 -5.626,2.25; 5 -5.626,1.75; 6 -5.626,1.25; 7 -5.626,0.75; 8 -5.626,0.25; 9 -5.626,-0.25; 10 -5.626,-0.75; 11 -5.626,-1.25; 12 -5.626,-1.75; 13 -5.626,-2.25; 14 -5.626,-2.75; 15 -5.626,-3.25; 16 -5.626,-3.75; 33 5.626,-3.75; 34 5.626,-3.25; 35 5.626,-2.75; 36 5.626,-2.25; 37 5.626,-1.75; 38 5.626,-1.25; 39 5.626,-0.75; 40 5.626,-0.25; 41 5.626,0.25; 42 5.626,0.75; 43 5.626,1.25; 44 5.626,1.75; 45 5.626,2.25; 46 5.626,2.75; 47 5.626,3.25; 48 5.626,3.75 | smd 0.229 x 1.473: 17 -3.75,-5.626; 18 -3.25,-5.626; 19 -2.75,-5.626; 20 -2.25,-5.626; 21 -1.75,-5.626; 22 -1.25,-5.626; 23 -0.75,-5.626; 24 -0.25,-5.626; 25 0.25,-5.626; 26 0.75,-5.626; 27 1.25,-5.626; 28 1.75,-5.626; 29 2.25,-5.626; 30 2.75,-5.626; 31 3.25,-5.626; 32 3.75,-5.626; 49 3.75,5.626; 50 3.25,5.626; 51 2.75,5.626; 52 2.25,5.626; 53 1.75,5.626; 54 1.25,5.626; 55 0.75,5.626; 56 0.25,5.626; 57 -0.25,5.626; 58 -0.75,5.626; 59 -1.25,5.626; 60 -1.75,5.626; 61 -2.25,5.626; 62 -2.75,5.626; 63 -3.25,5.626; 64 -3.75,5.626
LED-0603 = smd 1 x 1: A -0.877,0; C 0.877,0
SOD-323 = smd 0.63 x 0.83: A 1.15,0; C -1.15,0
1X04 = drill 1.016 pad 1.88: 1 0,0; 2 2.54,0; 3 5.08,0; 4 7.62,0
JST-2-PTH = drill 0.7 pad 1.6: 1 -1,0; 2 1,0
EMITTER = drill 0.8 pad 1.5: + -1.27,-0.5; - 1.27,-0.5
DMN3150LW = smd 0.7 x 0.9: D 0,0.95; G -0.65,-0.95; S 0.65,-0.95
SOT23-3@1 = smd 0.8 x 0.9: 1 -0.95,-1; 2 0.95,-1; 3 0,1.1
M0805 = smd 1.3 x 1.6: 1 -0.95,0; 2 0.95,0
1/6W-RES = drill 0.762: 1 -2.5,0; 2 2.5,0
0603-RES = smd 1.1 x 1: 1 -0.85,0; 2 0.85,0
RECEIVER = drill 0.8 pad 1.5: C 1.27,-0.5; E -1.27,-0.5
TACTILE_SWITCH_SMD_4.6X2.8MM = smd 0.9 x 1: 1 -2.05,-0.8; 2 2.05,-0.8; 3 2.05,0.8; 4 -2.05,0.8
SWITCH-SPDT = drill 1.016 pad 1.88: 1 0,2.54; 2 0,0; 3 0,-2.54
PAD-JUMPER-2-NC_BY_TRACE_YES_SILK = smd 0.635 x 1.27: 1 -0.508,0; 2 0.508,0
SOIC127P600X175-16N = smd 2.057 x 0.61: 1 -4.801,8.89; 2 -4.801,7.62; 3 -4.801,6.35; 4 -4.801,5.08; 5 -4.801,3.81; 6 -4.801,2.54; 7 -4.801,1.27; 8 -4.801,0; 9 0,0; 10 0,1.27; 11 0,2.54; 12 0,3.81; 13 0,5.08; 14 0,6.35; 15 0,7.62; 16 0,8.89
SOP65P640X120-17N = smd 1.57 x 0.41: 1 -2.87,2.275; 2 -2.87,1.625; 3 -2.87,0.975; 4 -2.87,0.325; 5 -2.87,-0.325; 6 -2.87,-0.975; 7 -2.87,-1.625; 8 -2.87,-2.275; 9 2.87,-2.275; 10 2.87,-1.625; 11 2.87,-0.975; 12 2.87,-0.325; 13 2.87,0.325; 14 2.87,0.975; 15 2.87,1.625; 16 2.87,2.275 | smd 2.105 x 3.115: 17 0,0
SOIC127P600X175-8N = smd 1.981 x 0.559: 1 -2.464,1.905; 2 -2.464,0.635; 3 -2.464,-0.635; 4 -2.464,-1.905; 5 2.464,-1.905; 6 2.464,-0.635; 7 2.464,0.635; 8 2.464,1.905
SOT23-5 = smd 0.55 x 1.2: 1 -0.95,-1.3; 2 0,-1.3; 3 0.95,-1.3; 4 0.95,1.3; 5 -0.95,1.3
JST_CONNECTOR_FEMALE = drill 0.889: + 0,1; - 0,-1
MY_MM_MOTOR_MOUNT = drill 0.95 pad 2: L_CHA -20.375,26.73; L_CHB -20.375,24.19; L_GND -20.375,45.27; L_MOTOR_A -2,37.27; L_MOTOR_B -2,34.73; L_VCC -20.375,47.81; R_CHA 20.375,45.27; R_CHB 20.375,47.81; R_GND 20.375,26.73; R_MOTOR_A 2,34.73; R_MOTOR_B 2,37.27; R_VCC 20.375,24.19 | hole 2.286: 14.85,45; 14.85,27; -14.85,27; -14.85,45

### Placement (x,y rotation side)
C1  -90.68,-227.84 0 top  (outside the outline)
C2  25.27,31.62 90 top
C3  29.59,31.62 90 top
C4  35.94,31.37 90 top
C5  -90.68,-230.38 0 top  (outside the outline)
C7  46.86,27.05 90 top
C8  50.42,27.05 90 top
C9  7.11,23.11 180 top
C10  13.72,26.92 180 top
C11  4.32,41.4 180 top
C12  -90.68,-222.76 0 top  (outside the outline)
C13  -90.68,-225.3 0 top  (outside the outline)
C19  13.72,45.72 180 top
C_E_H1  72.72,49.05 270 top
C_E_H2  74.75,49.05 270 top
C_ELF1  50.5,61.8 180 top
C_ELF2  56.85,58.24 180 top
C_EM_D1  76.43,37.03 270 top
C_EM_D2  78.46,37.03 270 top
C_ERF1  45.54,14.33 180 top
C_ERF2  51.89,19.15 180 top
CR1  57.81,45.26 0 top
D1  3.81,45.47 180 top
D2  10.41,22.86 180 top
D3  13.72,30.23 180 top
J1  62.36,25.27 90 top
JP2  17.78,38.61 180 top
LEFT_FRONT_EMITTER  59.52,70 275 top
NMOS1  54.23,60.17 0 top
NMOS2  74.04,29.62 270 top
NMOS3  53.67,10.41 180 top
NMOS4  70.92,24.23 270 top
Q1  13.72,23.62 180 top
R1  56.01,27.56 90 top
R3  10.41,45.72 180 top
R4  10.41,26.92 180 top
R5  12.19,49.28 180 top
R6  7.11,45.72 180 top
R7  7.11,26.92 180 top
R_ED1  75.84,33.63 0 top
R_ED2  75.84,31.57 0 top
R_ED_PD  71.65,29.41 90 top
R_EH1  73.91,24.08 0 top
R_EH2  73.91,26.11 0 top
R_EH_PD  68.48,24.03 90 top
R_ELF  54.05,63.58 0 top
R_ELF_PD  54.16,56.29 180 top
R_ERF  51.1,17.37 0 top
R_ERF_PD  53.87,13.26 0 top
R_RLD  75.41,46.51 0 top
R_RLF  57.61,63.37 90 top
R_RLH  67.87,53.72 0 top
R_RRD  77.27,28.7 0 top
R_RRF  60.93,20.8 270 top
R_RRH  71.27,20.85 270 top
R_VM1  13.72,51.82 180 top
R_VM2  13.72,54.86 180 top
REC_LF  62.25,64.25 273 top
S1  6.86,6.1 0 top
S2  3.81,54.1 180 top
SJ1  13.72,41.66 180 top
SJ2  13.72,19.05 180 top
U1  24.51,46.74 90 top
U2  7.62,42.42 90 top
U3  9.91,32.13 270 top
U4  13.46,14.99 180 top
U5  7.37,34.54 180 top
U$1  3.81,29.97 0 top
U$2  6.1,16.76 90 top
U$7  79,47 320 top
U$8  79,27 220 top
U$9  62.25,10.38 267 top
U$11  80,40 322 top
U$12  -3.94,37.63 270 top
U$13  59.91,5.02 265 top
U$17  80,34 218 top
U$18  76,52 0 top
U$19  76,22 180 top
U$20  70,18 180 top
U$21  70,56 0 top

### Tracks (layer width: path | path; a pad name or v marks a point on that pad's centre or on a via)
3.3V  (3 unrouted)
3V3  (10 unrouted)
5V  (13 unrouted)
A3.3V  (5 unrouted)
AGND  (5 unrouted)
  pour Top (no thermals): 75.72,29.31 77.09,29.21 77.09,29.31
D2_EM  (2 unrouted)
D_EM  (1 unrouted)
EM_D  (1 unrouted)
EM_H  (1 unrouted)
EM_RF  (1 unrouted)
GND  (50 unrouted)
H2_EM  (2 unrouted)
H_EM  (1 unrouted)
LABEL_ME  (1 unrouted)
LF_EM  (1 unrouted)
MUX_EN  (1 unrouted)
N$1  (1 unrouted)
N$3
  pour Bottom: 0,70 0,5 5,0 15,0 15,10 50,10 50,0 56,0 arc90 86,30 86,45 arc90 56,75 50,75 50,65 15,65 15,75 4.98,75
N$4
  pour Top: 0,70 0,5 5,0 15,0 15,10 50,10 50,0 56,0 arc90 86,30 86,45 arc90 56,75 50,75 50,65 15,65 15,75 4.98,75
N$5  (1 unrouted)
N$6  (1 unrouted)
N$7  (1 unrouted)
N$8  (1 unrouted)
N$9  (1 unrouted)
N$10  (1 unrouted)
N$11  (1 unrouted)
N$14  (2 unrouted)
N$16  (1 unrouted)
N$17  (1 unrouted)
N$18  (2 unrouted)
N$19  (2 unrouted)
NRST  (3 unrouted)
REC_LD  (2 unrouted)
REC_LF  (2 unrouted)
REC_LH  (2 unrouted)
REC_RD  (2 unrouted)
REC_RF  (2 unrouted)
REC_RH  (2 unrouted)
RF_EM  (1 unrouted)
SEL_A  (1 unrouted)
SEL_B  (1 unrouted)
SEL_C  (1 unrouted)
SWCLK  (1 unrouted)
SWDIO  (1 unrouted)
V_BAT  (1 unrouted)
V_BATT  (7 unrouted)
V_BATT_POWER  (3 unrouted)
V_USB  (5 unrouted)
VCC  (1 unrouted)
VIN  (4 unrouted)
VOLTMETER  (1 unrouted)

### Text on the board
tPlace: SN74HC15 | MUX | DRV8848 | ACS712 | RESET
Document: Notes / ----------------------- / Bottom layer - GND / Add net classes / Add power planes / Use vector font